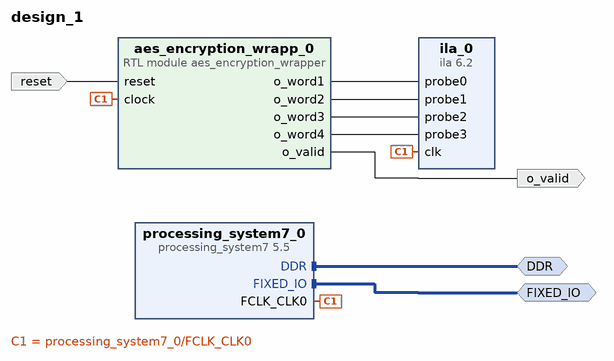
[diagram p0: block diagram of the top level]
# Vivado block design design_1, xc7z020clg400-1, Vivado 2018.1_AR70908
create_bd_design design_1

create_bd_intf_port -mode Master -vlnv xilinx.com:interface:ddrx_rtl:1.0 DDR
create_bd_intf_port -mode Master -vlnv xilinx.com:display_processing_system7:fixedio_rtl:1.0 FIXED_IO
create_bd_port -dir I -type rst reset
create_bd_port -dir O o_valid

create_bd_cell -type ip -vlnv xilinx.com:ip:processing_system7:5.5 processing_system7_0
set_property -dict {CONFIG.PCW_FPGA0_PERIPHERAL_FREQMHZ 250 CONFIG.PCW_USE_M_AXI_GP0 0} [get_bd_cells processing_system7_0]
# 29 more settings of processing_system7_0 are not shown: defaults, MIO pin electricals, DDR timing, and values the tool derives
create_bd_cell -type ip -vlnv xilinx.com:ip:ila:6.2 ila_0
set_property -dict [list \
  CONFIG.C_PROBE4_WIDTH 1 \
  CONFIG.C_PROBE3_WIDTH 32 \
  CONFIG.C_PROBE2_WIDTH 32 \
  CONFIG.C_PROBE1_WIDTH 32 \
  CONFIG.C_PROBE0_WIDTH 32 \
  CONFIG.C_NUM_OF_PROBES 4 \
  CONFIG.C_EN_STRG_QUAL 1 \
  CONFIG.C_ADV_TRIGGER true \
  CONFIG.C_PROBE4_MU_CNT 2 \
  CONFIG.C_PROBE3_MU_CNT 2 \
  CONFIG.C_PROBE2_MU_CNT 2 \
  CONFIG.C_PROBE1_MU_CNT 2 \
  CONFIG.C_PROBE0_MU_CNT 2 \
  CONFIG.ALL_PROBE_SAME_MU_CNT 2 \
  CONFIG.C_ENABLE_ILA_AXI_MON false \
  CONFIG.C_MONITOR_TYPE Native \
] [get_bd_cells ila_0]
create_bd_cell -type module -reference aes_encryption_wrapper aes_encryption_wrapp_0

# ---- connections ----

connect_bd_intf_net [get_bd_intf_ports DDR] [get_bd_intf_pins processing_system7_0/DDR]
connect_bd_intf_net [get_bd_intf_ports FIXED_IO] [get_bd_intf_pins processing_system7_0/FIXED_IO]
connect_bd_net [get_bd_pins processing_system7_0/FCLK_CLK0] [get_bd_pins ila_0/clk] [get_bd_pins aes_encryption_wrapp_0/clock]
connect_bd_net -net reset_0_1 [get_bd_ports reset] [get_bd_pins aes_encryption_wrapp_0/reset]
connect_bd_net [get_bd_pins aes_encryption_wrapp_0/o_valid] [get_bd_ports o_valid]
connect_bd_net [get_bd_pins aes_encryption_wrapp_0/o_word1] [get_bd_pins ila_0/probe0]
connect_bd_net [get_bd_pins aes_encryption_wrapp_0/o_word2] [get_bd_pins ila_0/probe1]
connect_bd_net [get_bd_pins aes_encryption_wrapp_0/o_word3] [get_bd_pins ila_0/probe2]
connect_bd_net [get_bd_pins aes_encryption_wrapp_0/o_word4] [get_bd_pins ila_0/probe3]

validate_bd_design
save_bd_design
